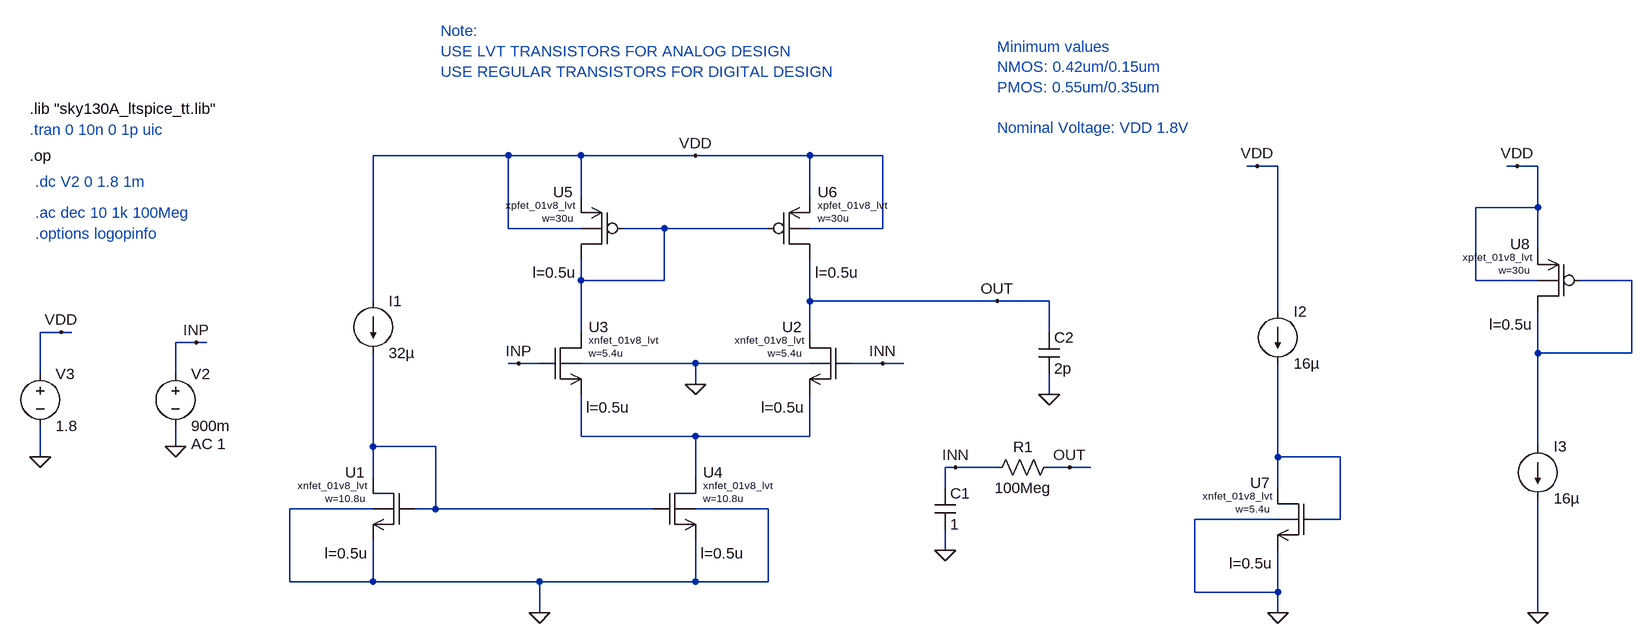
[diagram p0: schematic OTA_Simple.asc]
OTA_Simple.asc, the LTspice schematic file:
Version 4.1
SHEET 1 6080 1492
WIRE 864 -304 656 -304
WIRE 976 -304 864 -304
WIRE 1152 -304 976 -304
WIRE 1328 -304 1152 -304
WIRE 1440 -304 1328 -304
WIRE 2016 -288 2000 -288
WIRE 2048 -288 2016 -288
WIRE 2416 -288 2400 -288
WIRE 2448 -288 2416 -288
WIRE 976 -240 976 -304
WIRE 1328 -240 1328 -304
WIRE 2448 -224 2448 -288
WIRE 2448 -224 2352 -224
WIRE 864 -192 864 -304
WIRE 976 -192 864 -192
WIRE 1104 -192 1040 -192
WIRE 1264 -192 1104 -192
WIRE 1440 -192 1440 -304
WIRE 1440 -192 1328 -192
WIRE 2448 -160 2448 -224
WIRE 976 -112 976 -144
WIRE 1104 -112 1104 -192
WIRE 1104 -112 976 -112
WIRE 2352 -112 2352 -224
WIRE 2448 -112 2352 -112
WIRE 2592 -112 2512 -112
WIRE 656 -80 656 -304
WIRE 1328 -80 1328 -144
WIRE 1616 -80 1328 -80
WIRE 1696 -80 1616 -80
WIRE 2048 -64 2048 -288
WIRE 176 -32 144 -32
WIRE 192 -32 176 -32
WIRE 976 -32 976 -112
WIRE 1328 -32 1328 -80
WIRE 1696 -32 1696 -80
WIRE 384 -16 352 -16
WIRE 400 -16 384 -16
WIRE 2448 0 2448 -64
WIRE 2592 0 2592 -112
WIRE 2592 0 2448 0
WIRE 880 16 864 16
WIRE 912 16 880 16
WIRE 1152 16 976 16
WIRE 1328 16 1152 16
WIRE 1440 16 1392 16
WIRE 1472 16 1440 16
WIRE 144 32 144 -32
WIRE 352 32 352 -16
WIRE 1152 48 1152 16
WIRE 1696 64 1696 32
WIRE 976 128 976 64
WIRE 1152 128 976 128
WIRE 1328 128 1328 64
WIRE 1328 128 1152 128
WIRE 352 144 352 112
WIRE 656 144 656 0
WIRE 752 144 656 144
WIRE 2448 144 2448 0
WIRE 144 160 144 112
WIRE 2048 160 2048 16
WIRE 2144 160 2048 160
WIRE 1552 176 1536 176
WIRE 1616 176 1552 176
WIRE 1728 176 1696 176
WIRE 1760 176 1728 176
WIRE 656 192 656 144
WIRE 1152 192 1152 128
WIRE 1536 208 1536 176
WIRE 2048 208 2048 160
WIRE 656 240 528 240
WIRE 752 240 752 144
WIRE 752 240 720 240
WIRE 1088 240 752 240
WIRE 1264 240 1152 240
WIRE 2048 256 1920 256
WIRE 2144 256 2144 160
WIRE 2144 256 2112 256
WIRE 1536 304 1536 272
WIRE 528 352 528 240
WIRE 656 352 656 288
WIRE 656 352 528 352
WIRE 912 352 656 352
WIRE 1152 352 1152 288
WIRE 1152 352 912 352
WIRE 1264 352 1264 240
WIRE 1264 352 1152 352
WIRE 1920 368 1920 256
WIRE 2048 368 2048 304
WIRE 2048 368 1920 368
WIRE 912 400 912 352
WIRE 2048 400 2048 368
WIRE 2448 400 2448 224
FLAG 176 -32 VDD
FLAG 144 160 0
FLAG 352 144 0
FLAG 384 -16 INP
FLAG 1152 48 0
FLAG 1440 16 INN
FLAG 880 16 INP
FLAG 1616 -80 OUT
FLAG 1152 -304 VDD
FLAG 1536 304 0
FLAG 1552 176 INN
FLAG 1728 176 OUT
FLAG 912 400 0
FLAG 1696 64 0
FLAG 2048 400 0
FLAG 2016 -288 VDD
FLAG 2448 400 0
FLAG 2416 -288 VDD
DATAFLAG 720 144 ""
DATAFLAG 1104 128 ""
DATAFLAG 1152 -192 ""
DATAFLAG 1456 -80 ""
DATAFLAG 2112 160 ""
DATAFLAG 2496 0 "$"
SYMBOL voltage 144 16 R0
WINDOW 123 0 0 Left 0
WINDOW 39 0 0 Left 0
SYMATTR InstName V3
SYMATTR Value 1.8
SYMBOL voltage 352 16 R0
WINDOW 123 24 124 Left 2
WINDOW 39 0 0 Left 0
SYMATTR Value2 AC 1
SYMATTR InstName V2
SYMATTR Value 900m
SYMBOL current 656 -80 R0
WINDOW 123 0 0 Left 0
WINDOW 39 0 0 Left 0
SYMATTR InstName I1
SYMATTR Value 32µ
SYMBOL res 1712 160 R90
WINDOW 0 0 56 VBottom 2
WINDOW 3 32 56 VTop 2
SYMATTR InstName R1
SYMATTR Value 100Meg
SYMBOL cap 1520 208 R0
SYMATTR InstName C1
SYMATTR Value 1
SYMBOL cap 1680 -32 R0
SYMATTR InstName C2
SYMATTR Value 2p
SYMBOL current 2048 -64 R0
WINDOW 123 0 0 Left 0
WINDOW 39 0 0 Left 0
SYMATTR InstName I2
SYMATTR Value 16µ
SYMBOL xnch 2096 208 M0
WINDOW 123 56 116 Left 2
SYMATTR Value2 l=0.5u
SYMATTR InstName U7
SYMATTR Value w=5.4u
SYMATTR SpiceModel xnfet_01v8_lvt
SYMBOL current 2448 144 R0
WINDOW 123 0 0 Left 0
WINDOW 39 0 0 Left 0
SYMATTR InstName I3
SYMATTR Value 16µ
SYMBOL xpch 2496 -160 M0
WINDOW 123 56 116 Left 2
SYMATTR Value2 l=0.5u
SYMATTR InstName U8
SYMATTR Value w=30u
SYMATTR SpiceModel xpfet_01v8_lvt
SYMBOL xnch 704 192 M0
WINDOW 123 56 116 Left 2
SYMATTR Value2 l=0.5u
SYMATTR InstName U1
SYMATTR Value w=10.8u
SYMATTR SpiceModel xnfet_01v8_lvt
SYMBOL xnch 1376 -32 M0
WINDOW 123 56 116 Left 2
SYMATTR Value2 l=0.5u
SYMATTR InstName U2
SYMATTR Value w=5.4u
SYMATTR SpiceModel xnfet_01v8_lvt
SYMBOL xnch 928 -32 R0
WINDOW 123 56 116 Left 2
SYMATTR Value2 l=0.5u
SYMATTR InstName U3
SYMATTR Value w=5.4u
SYMATTR SpiceModel xnfet_01v8_lvt
SYMBOL xnch 1104 192 R0
WINDOW 123 56 116 Left 2
SYMATTR Value2 l=0.5u
SYMATTR InstName U4
SYMATTR Value w=10.8u
SYMATTR SpiceModel xnfet_01v8_lvt
SYMBOL xpch 1024 -240 M0
WINDOW 123 56 116 Left 2
SYMATTR Value2 l=0.5u
SYMATTR InstName U5
SYMATTR Value w=30u
SYMATTR SpiceModel xpfet_01v8_lvt
SYMBOL xpch 1280 -240 R0
WINDOW 123 56 116 Left 2
SYMATTR Value2 l=0.5u
SYMATTR InstName U6
SYMATTR Value w=30u
SYMATTR SpiceModel xpfet_01v8_lvt
TEXT 128 -304 Left 2 !.op
TEXT 128 -376 Left 2 !.lib "sky130A_ltspice_tt.lib"
TEXT 128 -344 Left 2 ;.tran 0 10n 0 1p uic
TEXT 136 -264 Left 2 ;.dc V2 0 1.8 1m
TEXT 136 -216 Left 2 ;.ac dec 10 1k 100Meg
TEXT 136 -184 Left 2 ;.options logopinfo
TEXT 1616 -472 Left 2 ;Minimum values\nNMOS: 0.42um/0.15um\nPMOS: 0.55um/0.35um\n \nNominal Voltage: VDD 1.8V
TEXT 760 -496 Left 2 ;Note:\nUSE LVT TRANSISTORS FOR ANALOG DESIGN\nUSE REGULAR TRANSISTORS FOR DIGITAL DESIGN

The netlist it stands for:
* OTA_Simple.asc
V3 VDD 0 1.8
V2 INP 0 900m AC 1
I1 VDD N004 32µ
R1 OUT INN 100Meg
C1 INN 0 1
C2 OUT 0 2p
I2 VDD N005 16µ
X§U7 N005 N005 0 0 xnfet_01v8_lvt w=5.4u l=0.5u  ; pins D G S B
I3 N002 0 16µ
X§U8 N002 N002 VDD VDD xpfet_01v8_lvt w=30u l=0.5u  ; pins D G S B
X§U1 N004 N004 0 0 xnfet_01v8_lvt w=10.8u l=0.5u  ; pins D G S B
X§U2 OUT INN N003 0 xnfet_01v8_lvt w=5.4u l=0.5u  ; pins D G S B
X§U3 N001 INP N003 0 xnfet_01v8_lvt w=5.4u l=0.5u  ; pins D G S B
X§U4 N003 N004 0 0 xnfet_01v8_lvt w=10.8u l=0.5u  ; pins D G S B
X§U5 N001 N001 VDD VDD xpfet_01v8_lvt w=30u l=0.5u  ; pins D G S B
X§U6 OUT N001 VDD VDD xpfet_01v8_lvt w=30u l=0.5u  ; pins D G S B
.op
.lib "sky130A_ltspice_tt.lib"
* .tran 0 10n 0 1p uic
* .dc V2 0 1.8 1m
* .ac dec 10 1k 100Meg
* .options logopinfo
* Minimum values
* NMOS: 0.42um/0.15um
* PMOS: 0.55um/0.35um
* Nominal Voltage: VDD 1.8V
* Note:
* USE LVT TRANSISTORS FOR ANALOG DESIGN
* USE REGULAR TRANSISTORS FOR DIGITAL DESIGN
.backanno
.end